# Altium schematic sheet peripherials.SchDoc: Automatická videohlava
size A4; ApprovedBy: app by; CheckedBy: check by; Author: author; CompanyName: company; DrawnBy: Jiří Kyzlink; Organization: SPŠE Brno, Kounicova 16; Address1: L3, 12a Rodborough Rd; Address2: Frenchs Forest; Address3: NSW; Address4: Australia 2086; DocumentNumber: 3; Revision: A; SheetNumber: 3; SheetTotal: 3; DocumentName: hlava; ProjectName: hlava
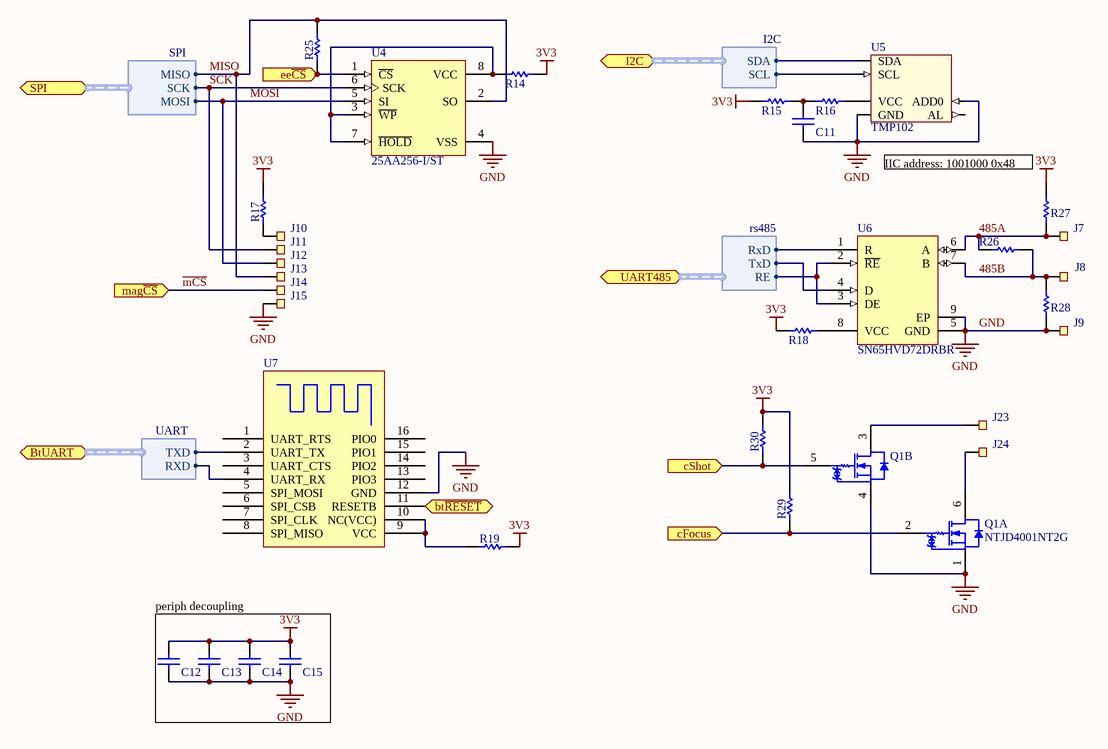
[diagram p0: peripherials.SchDoc]

## Parts
(Parts that share a designator on the sheet are numbered #1, #2 ... from top to bottom, then left to right.)
C11  CAP 100nF 6.3V 0402(1005)  [CAPC0402(1005)60_L]  (value not drawn)
C12  CAP 100nF 6.3V 0402(1005)  [CAPC0402(1005)60_L]  (value not drawn)
C13  CAP 100nF 6.3V 0402(1005)  [CAPC0402(1005)60_L]  (value not drawn)
C14  CAP 100nF 6.3V 0402(1005)  [CAPC0402(1005)60_L]  (value not drawn)
C15  CAP 100nF 6.3V 0402(1005)  [CAPC0402(1005)60_L]  (value not drawn)
J7  smd pad  [pad 0.75x1.5mm]  (value not drawn)
J8  smd pad  [pad 0.75x1.5mm]  (value not drawn)
J9  smd pad  [pad 0.75x1.5mm]  (value not drawn)
J10  smd pad  [pad 0.75x1.5mm]  (value not drawn)
J11  smd pad  [pad 0.75x1.5mm]  (value not drawn)
J12  smd pad  [pad 0.75x1.5mm]  (value not drawn)
J13  smd pad  [pad 0.75x1.5mm]  (value not drawn)
J14  smd pad  [pad 0.75x1.5mm]  (value not drawn)
J15  smd pad  [pad 0.75x1.5mm]  (value not drawn)
J23  smd pad  [pad 0.75x1.5mm]  (value not drawn)
J24  smd pad  [pad 0.75x1.5mm]  (value not drawn)
Q1#1  NTJD4001NT2G  [ONSC-SOT-363-6-419B-02_W_V]  (value not drawn)  (part B of 2)
Q1#2  NTJD4001NT2G  [ONSC-SOT-363-6-419B-02_W_V]  (part A of 2)
R14  Jumper 0402(1005)  [RESC0402(1005)_L]  (value not drawn)
R15  Jumper 0402(1005)  [RESC0402(1005)_L]  (value not drawn)
R16  4K7 1% 0402(1005)  [RESC0402(1005)_L]  (value not drawn)
R17  Jumper 0402(1005)  [RESC0402(1005)_L]  (value not drawn)
R18  Jumper 0402(1005)  [RESC0402(1005)_L]  (value not drawn)
R19  Jumper 0402(1005)  [RESC0402(1005)_L]  (value not drawn)
R25  39K 5% 0402(1005)  [RESC0402(1005)_L]  (value not drawn)
R26  120R 5% 0402(1005)  [RESC0402(1005)_L]  (value not drawn)
R27  560R 5% 0402(1005)  [RESC0402(1005)_L]  (value not drawn)
R28  560R 5% 0402(1005)  [RESC0402(1005)_M]  (value not drawn)
R29  39K 5% 0402(1005)  [RESC0402(1005)_L]  (value not drawn)
R30  39K 5% 0402(1005)  [RESC0402(1005)_L]  (value not drawn)
U4  25AA256-I/ST  [TSSOP-ST8_L]
U5  TMP102  [DRL6]
U6  SN65HVD72DRBR  [TI-DRB8-2400X1650TP_V]
U7  www.jnhuamao.cn  [HM_05_06_07_11]  (value not drawn)

## Blocks framed on the sheet
periph decoupling: C12-C15

## Ports
BtUART (harness UART), bt~{RESET} (in), cFocus (in), cShot (in), ee~{CS} (in), I2C (harness I2C), mag~{CS} (in), SPI (harness SPI), UART485 (harness rs485)

## Harnesses
I2C: SCL, SDA
rs485: RE, RxD, TxD
SPI: MISO, MOSI, SCK
UART: RXD, TXD

## Nets
3V3: C12.1 C13.1 C14.1 C15.1 R14.2 R15.1 R17.2 R18.1 R19.2 R27.2 R29.2 R30.2
GND: C11.1 C12.2 C13.2 C14.2 C15.2 J9.0 J15.0 Q1#1.4(S2) Q1#2.1(S1) R28.1 U4.4(VSS) U5.2(GND) U5.4(ADD0) U6.5(GND) U6.9(EP) U7.12(GND)
485A: J7.0 R26.1 R27.1 U6.6(A)
485B: J8.0 R26.2 R28.2 U6.7(B)
bt~{RESET}: U7.11(RESETB) ; port bt~{RESET}
cFocus: Q1#2.2(G1) R29.1 ; port cFocus
cShot: Q1#1.5(G2) R30.1 ; port cShot
ee~{CS}: R25.1 U4.1(~{CS}) ; port ee~{CS}
~{mCS}: J14.0 ; port mag~{CS}
MISO: J13.0 R25.2 U4.2(SO) ; port SPI.MISO
MOSI: J12.0 U4.5(SI) ; port SPI.MOSI
SCK: J11.0 U4.6(SCK) ; port SPI.SCK
NetC11_2: C11.2 R15.2 R16.2
NetJ10_0: J10.0 R17.1
NetJ23_0: J23.0 Q1#1.3(D2)
NetJ24_0: J24.0 Q1#2.6(D1)
NetR14_1: R14.1 U4.3(~{WP}) U4.7(~{HOLD}) U4.8(VCC)
NetR16_1: R16.1 U5.5(VCC)
NetR18_2: R18.2 U6.8(VCC)
NetR19_1: R19.1 U7.9(VCC) U7.10(NC(VCC))
NetU5_1: U5.1(SCL) ; port I2C.SCL
NetU5_6: U5.6(SDA) ; port I2C.SDA
NetU6_1: U6.1(R) ; port UART485.RxD
NetU6_2: U6.2(~{RE}) U6.3(DE) ; port UART485.RE
NetU6_4: U6.4(D) ; port UART485.TxD
NetU7_2: U7.2(UART_TX) ; port BtUART.TXD
NetU7_4: U7.4(UART_RX) ; port BtUART.RXD

Not connected (* = marked no-connect by the designer): U5 3(AL); U7 1(UART_RTS) 3(UART_CTS) 5(SPI_MOSI) 6(SPI_CSB) 7(SPI_CLK) 8(SPI_MISO) 13(PIO3) 14(PIO2) 15(PIO1) 16(PIO0)

## Notes on the sheet
- IIC address: 1001000 0x48
- Date:
- Size:
- Title
- A4
- Draw:
- Time:
- Revision:
- Sheet
- of
- File:

## Library data of the parts
C11-C15 = CMP-1034-02060-1: CAP 100nF 6.3V ±5% 0402 (1005 Metric) Thickness 0.6mm SMD; Case-EIA: 0402; Case-Metric: 1005; Rated Voltage: 6.3 V; Max Thickness: 0.6 mm; Value: 100nF; Tolerance: ±5%; Technology: SMT
J7-J15 J23 J24 = pad
Q1#1 Q1#2 = CMP-1058-00811-1: Small Signal MOSFET 30 V, 250 mA, Dual N-Channel, 6-Pin SOT-363, Pb-Free, Tape and Reel; Manufacturer: On Semiconductor; VGS Max (V): 20; Coss Typ (pF): 19; ID Max (A): 0.25; PD Max (W): 0.272; Channel Polarity: N Channel; VGS(th) Max (V): 1.5; Crss Typ (pF): 7.25; V(BR)DSS Min (V): 30; Package Type: SC-88-6 / SC-70-6 / SOT-363-6; PackageVersion: Rev. W, 01/2006; Configuration: Dual; PackageDescription: 6-Pin Small Outline Transistor, Body 2 x 1.25 mm, Pitch 0.65 mm; ComponentLink1Description: Manufacturer URL; PartNumber: NTJD4001NT2G; Ciss Typ (pF): 20; ComponentLink1URL: http://www.onsemi.com/; Packing: Tape and Reel; ComponentLink3URL: http://www.onsemi.com/pub_link/Collateral/NTJD4001N-D.PDF; ComponentLink3Description: Package Specification; Mounting Technology: Surface Mount; DatasheetVersion: Rev. 6; RoHS: Pb-Free; ComponentLink2URL: http://www.onsemi.com/pub_link/Collateral/NTJD4001N-D.PDF; PackageReference: SOT-363-6-419B-02_W; ComponentLink2Description: Datasheet
R14 R15 R17-R19 = CMP-1011-00001-1: Jumper 0402 (1005 Metric); Tolerance: None; Case-Metric: 1005; Case-EIA: 0402; Value: 0.00 Ohm; Power: None; Technology: SMT
R16 = CMP-1011-00586-1: 4K7 0.063W 1% 0402 (1005 Metric)  SMD; Case-Metric: 1005; Value: 4700.00 Ohm; Case-EIA: 0402; Power: 0.063 W; Technology: SMT; Tolerance: 1 %
R25 R29 R30 = CMP-1011-00112-1: 39K 0.063W 5% 0402 (1005 Metric)  SMD; Case-Metric: 1005; Value: 39000.00 Ohm; Case-EIA: 0402; Technology: SMT; Tolerance: 5 %; Power: 0.063 W
R26 = CMP-1011-00052-1: 120R 0.063W 5% 0402 (1005 Metric)  SMD; Value: 120.00 Ohm; Case-EIA: 0402; Case-Metric: 1005; Technology: SMT; Tolerance: 5 %; Power: 0.063 W
R27 R28 = CMP-1011-00068-1: 560R 0.063W 5% 0402 (1005 Metric)  SMD; Case-Metric: 1005; Case-EIA: 0402; Value: 560.00 Ohm; Tolerance: 5 %; Power: 0.063 W; Technology: SMT
U4 = CMP-0165-00405-1: 256K SPI Bus Serial EEPROM, 8-Pin TSSOP, Industrial Temperature; Code_JEDEC: MO-153; DatasheetVersion: revF, May-2007; PackageDescription: 8-Lead Plastic Thin Shrink Small Outline (ST) - 4.4mm Body [TSSOP]; PackageReference: TSSOP-ST8; PackageVersion: revBB, Aug-2009
U5 = TMP102: Low Power Digital Temperature Sensor  With SMBus™/Two-Wire Serial Interface in SOT563; PART#: TMP102AIDRLT
U6 = CMP-0694-00017-1: 3.3 V Supply RS-485 with IEC ESD Protection, 0.25 Mbps, -40 to 125 degC, 8-Pin SON, RoHS, Tape and Reel; Manufacturer: Texas Instruments; VCC: 3 to 3.6 V; No. of TX: 1; ICC (Max) (mA): 0.95; Signaling Rate (Max) (Mbps): 0.25; VI: -7 to 12 V; ESD: 15 kV; ComponentLink3Description: Package Specification; No. of RX: 1; ComponentLink2URL: http://www.ti.com/lit/ds/sllse11c/sllse11c.pdf; ComponentLink2Description: Datasheet; DatasheetVersion: SLLSE11C; PackageVersion: 4203482-2/K; PartNumber: SN65HVD72DRBR; RoHS: TRUE; PackageReference: DRB-8; Operating Temperature Range: -40 to 125 degC; ComponentLink1Description: Manufacturer URL; Packing: Tape and Reel; PackageDescription: 8-Pin Plastic Small Outline No-Lead, Body 3 x 3 mm, Pitch 0.65 mm; Mounting Technology: Surface Mount; ComponentLink3URL: http://www.ti.com/lit/ds/sllse11c/sllse11c.pdf; ComponentLink1URL: http://www.ti.com/
U7 = HM_05_06_07_11: HM bluetooth module HM-05,HM-06,HM-07, HM-11